# EAGLE schematic NanoBoard (EAGLE 7.2.0)
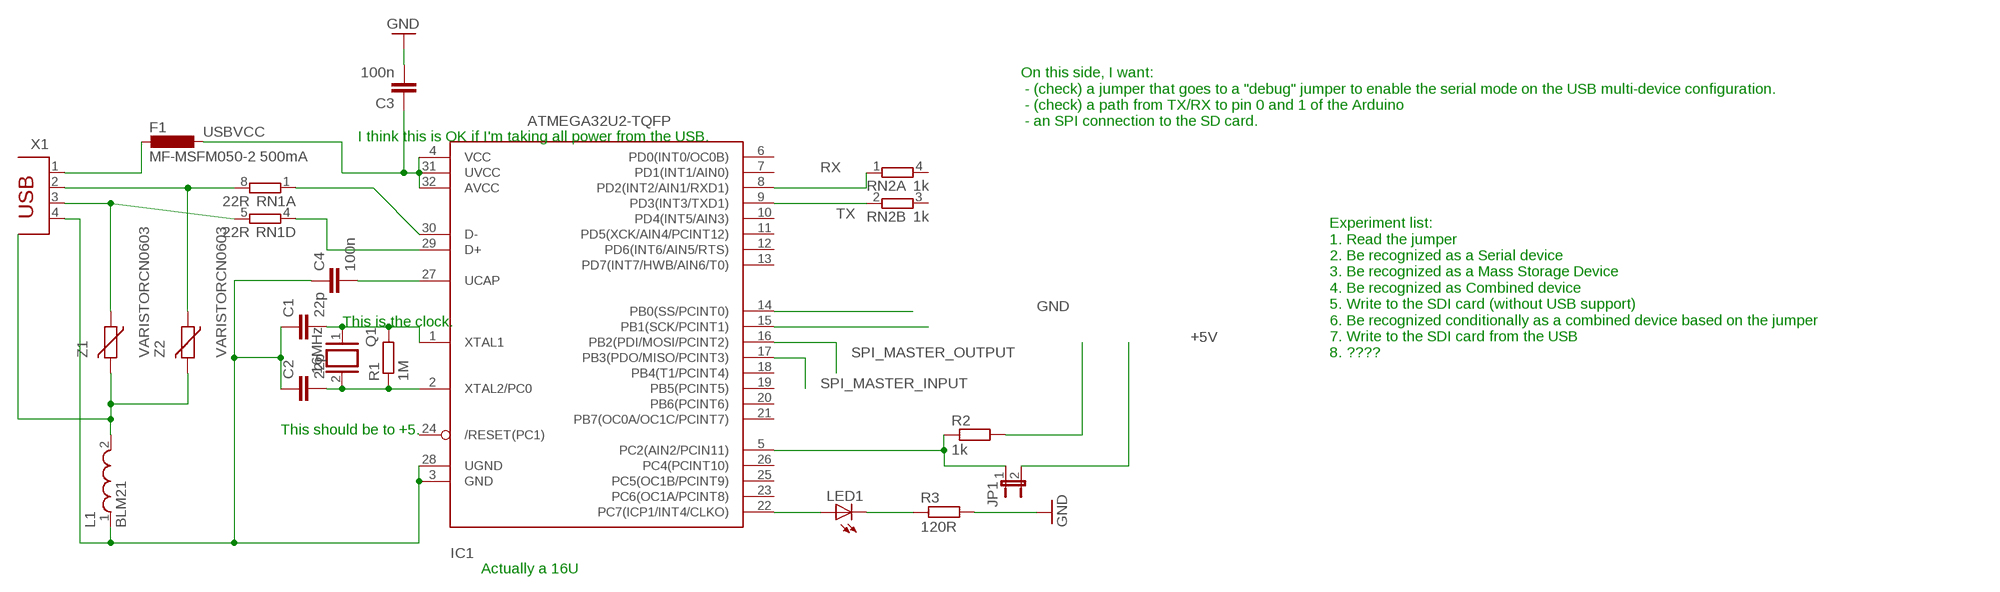
[diagram p0: schematic, sheet 1]

## Parts
C1  22p  C2.5/2  [C2.5-2]
C2  22p  C2.5/2  [C2.5-2]
C3  100n  C2.5/2  [C2.5-2]
C4  100n  C2,5-3  [C2.5-3]
F1  MF-MSFM050-2 500mA  L-EUL1812  [L1812]
IC1  ATMEGA32U2-TQFP  [TQFP32-08]
JP1  JP1E  [JP1]
L1  BLM21  WE-CBF_0805(WB/HS)  [WE-CBF_0805(W=3.0)]
LED1  LED  [SMARTLED-TTW]
Q1  16MHz  XTAL/S  [QS]
R1  1M  R-EU_R0603  [R0603]
R2  1k  R-EU_0204/2V  [0204V]
R3  120R  R-EU_0204/2V  [0204V]
RN1  22R  4R-NCAY16  [CAY16]
RN2  1k  2R-NEXB14V  [EXB14V]
X1  PN61729  [PN61729]
Z1  VARISTORCN0603  [CT/CN0603]
Z2  VARISTORCN0603  [CT/CN0603]

## Nets
+5V: JP1.2
GND: C3.2 R2.2 R3.2
N$1: F1.2 X1.1
N$2: RN1.8 X1.2 Z2.1
N$3: RN1.5 X1.3 Z1.1
N$4: L1.2 Z1.2 Z2.2
N$5: C4.2 IC1.27(UCAP)
N$6: IC1.30(D-) RN1.1
N$7: IC1.29(D+) RN1.4
N$8: C1.2 IC1.1(XTAL1) Q1.1 R1.2
N$9: C2.2 IC1.2(XTAL2/PC0) Q1.2 R1.1
N$10: C1.1 C2.1 C4.1 IC1.3(GND) IC1.28(UGND) L1.1 X1.4
N$11: IC1.5(PC2(AIN2/PCIN11)) JP1.1 R2.1
N$12: IC1.15(PB1(SCK/PCINT1))
N$13: IC1.14(PB0(SS/PCINT0))
N$14: IC1.22(PC7(ICP1/INT4/CLKO)) LED1.A@1(A)
N$15: LED1.C@1(C) R3.1
RX: IC1.8(PD2(INT2/AIN1/RXD1)) RN2.1
SPI_MASTER_INPUT: IC1.17(PB3(PDO/MISO/PCINT3))
SPI_MASTER_OUTPUT: IC1.16(PB2(PDI/MOSI/PCINT2))
TX: IC1.9(PD3(INT3/TXD1)) RN2.2
USBVCC: C3.1 F1.1 IC1.4(VCC) IC1.31(UVCC) IC1.32(AVCC)
Unconnected: IC1.6(PD0(INT0/OC0B)) IC1.7(PD1(INT1/AIN0)) IC1.10(PD4(INT5/AIN3)) IC1.11(PD5(XCK/AIN4/PCINT12)) IC1.12(PD6(INT6/AIN5/RTS)) IC1.13(PD7(INT7/HWB/AIN6/T0)) IC1.18(PB4(T1/PCINT4)) IC1.19(PB5(PCINT5)) IC1.20(PB6(PCINT6)) IC1.21(PB7(OC0A/OC1C/PCINT7)) IC1.23(PC6(OC1A/PCINT8)) IC1.24(/RESET(PC1)) IC1.25(PC5(OC1B/PCINT9)) IC1.26(PC4(PCINT10)) RN1.2 RN1.3 RN1.6 RN1.7 RN2.3 RN2.4

## Notes on the sheet
- On this side, I want:
   - (check) a jumper that goes to a "debug" jumper to enable the serial mode on the USB multi-device configuration.
   - (check) a path from TX/RX to pin 0 and 1 of the Arduino
   - an SPI connection to the SD card.
- I think this is OK if I'm taking all power from the USB.
- This is the clock.
- Experiment list:
  1. Read the jumper
  2. Be recognized as a Serial device
  3. Be recognized as a Mass Storage Device
  4. Be recognized as Combined device
  5. Write to the SDI card (without USB support)
  6. Be recognized conditionally as a combined device based on the jumper
  7. Write to the SDI card from the USB
  8. ????
- This should be to +5.
- Actually a 16U

## Library data of the parts
C1-C4 = capacitor-wima:C: CAPACITOR naming: grid - package width
F1 = rcl:L-EU: INDUCTOR, European symbol
IC1 = adafruit:ATMEGA32U2: ATmega32u2 Pin compatible with the atmega8u2, atmega16u2 and atmega32u2 8, 16 or 32 K flash, 1K RAM, 512b EEPROM 8 bit and 16 bit timer (5 PWM total) UART, SPI (no I2C!) USB with 4 endpoints, LUFA compatible 22 I/O lines, analog comparator (no ADC!) Comes with DFU bootloader burned in!
JP1 = jumper:JP1E: JUMPER
L1 = Wurth_Elektronik_Passive_rev15b:WE-CBF: WE-CBF SMD EMI Suppression Ferrite Bead Characteristics Reliable Ni-Sn electrodes High rated current up to 6 A Operating temperature: –55 ºC to +125 ºC Applications Perfect as data lined filter and for uncoupling of distribution voltage Variant abbreviation WB means WIDE BAND HS means HIGH SPEED HC means HIGH CURRENT <http://katalog.we-online.de/media/images/eisos/FeCBF_pf2.jpg> Details see: http://katalog.we-online.de/en/pbs/WE-CBF Updated on 2014-06-19 2014 (C) Wurth Elektronik
LED1 = adafruit:LED: LED OSRAM: - CHIPLED LG R971, LG N971, LY N971, LG Q971, LY Q971, LO R971, LY R971 LH N974, LH R974 LS Q976, LO Q976, LY Q976 LO Q996 - Hyper CHIPLED LW Q18S LB Q993, LB Q99A, LB R99A - SideLED LS A670, LO A670, LY A670, LG A670, LP A670 LB A673, LV A673, LT A673, LW A673 LH A674 LY A675 LS A676, LA A676, LO A676, LY A676, LW A676 LS A679, LY A679, LG A679 - Hyper Micro SIDELED® LS Y876, LA Y876, LO Y876, LY Y876 LT Y87S - SmartLED LW L88C, LW L88S LB L89C, LB L89S, LG L890 LS L89K, LO L89K, LY L89K LS L896, LA L896, LO L896, LY L896 - TOPLED LS T670, LO T670, LY T670, LG T670, LP T670 LSG T670, LSP T670, LSY T670, LOP T670, LYG T670 LG T671, LOG T671, LSG T671 LB T673, LV T673, LT T673, LW T673 LH T674 LS T676, LA T676, LO T676, LY T676, LB T676, LH T676, LSB T676, LW T676 LB T67C, LV T67C, LT T67C, LS T67K, LO T67K, LY T67K, LW E67C LS E67B, LA E67B, LO E67B, LY E67B, LB E67C, LV E67C, LT E67C LW T67C LS T679, LY T679, LG T679 LS T770, LO T770, LY T770, LG T770, LP T770 LB T773, LV T773, LT T773, LW T773 LH T774 LS E675, LA E675, LY E675, LS T675 LS T776, LA T776, LO T776, LY T776, LB T776 LHGB T686 LT T68C, LB T68C - Hyper Mini TOPLED® LB M676 - Mini TOPLED Santana® LG M470 LS M47K, LO M47K, LY M47K Source: http://www.osram.convergy.de/
Q1 = special:XTAL/S: CRYSTAL
R1-R3 = resistor:R-EU_: RESISTOR, European symbol
RN1 = resistor-dil:4R-N: Array Chip Resistor Source: RS Component / Phycomp; OC_FARNELL: unknown; OC_NEWARK: unknown
RN2 = resistor-dil:2R-N: Array Chip Resistor Source: Panasonic; OC_FARNELL: unknown; OC_NEWARK: unknown
X1 = con-berg:PN61729: BERG USB connector; OC_FARNELL: unknown; OC_NEWARK: unknown
Z1 Z2 = varistor:VARISTOR: VARISTOR